# EAGLE design USBchLDO_v2 (EAGLE 8.6.0)
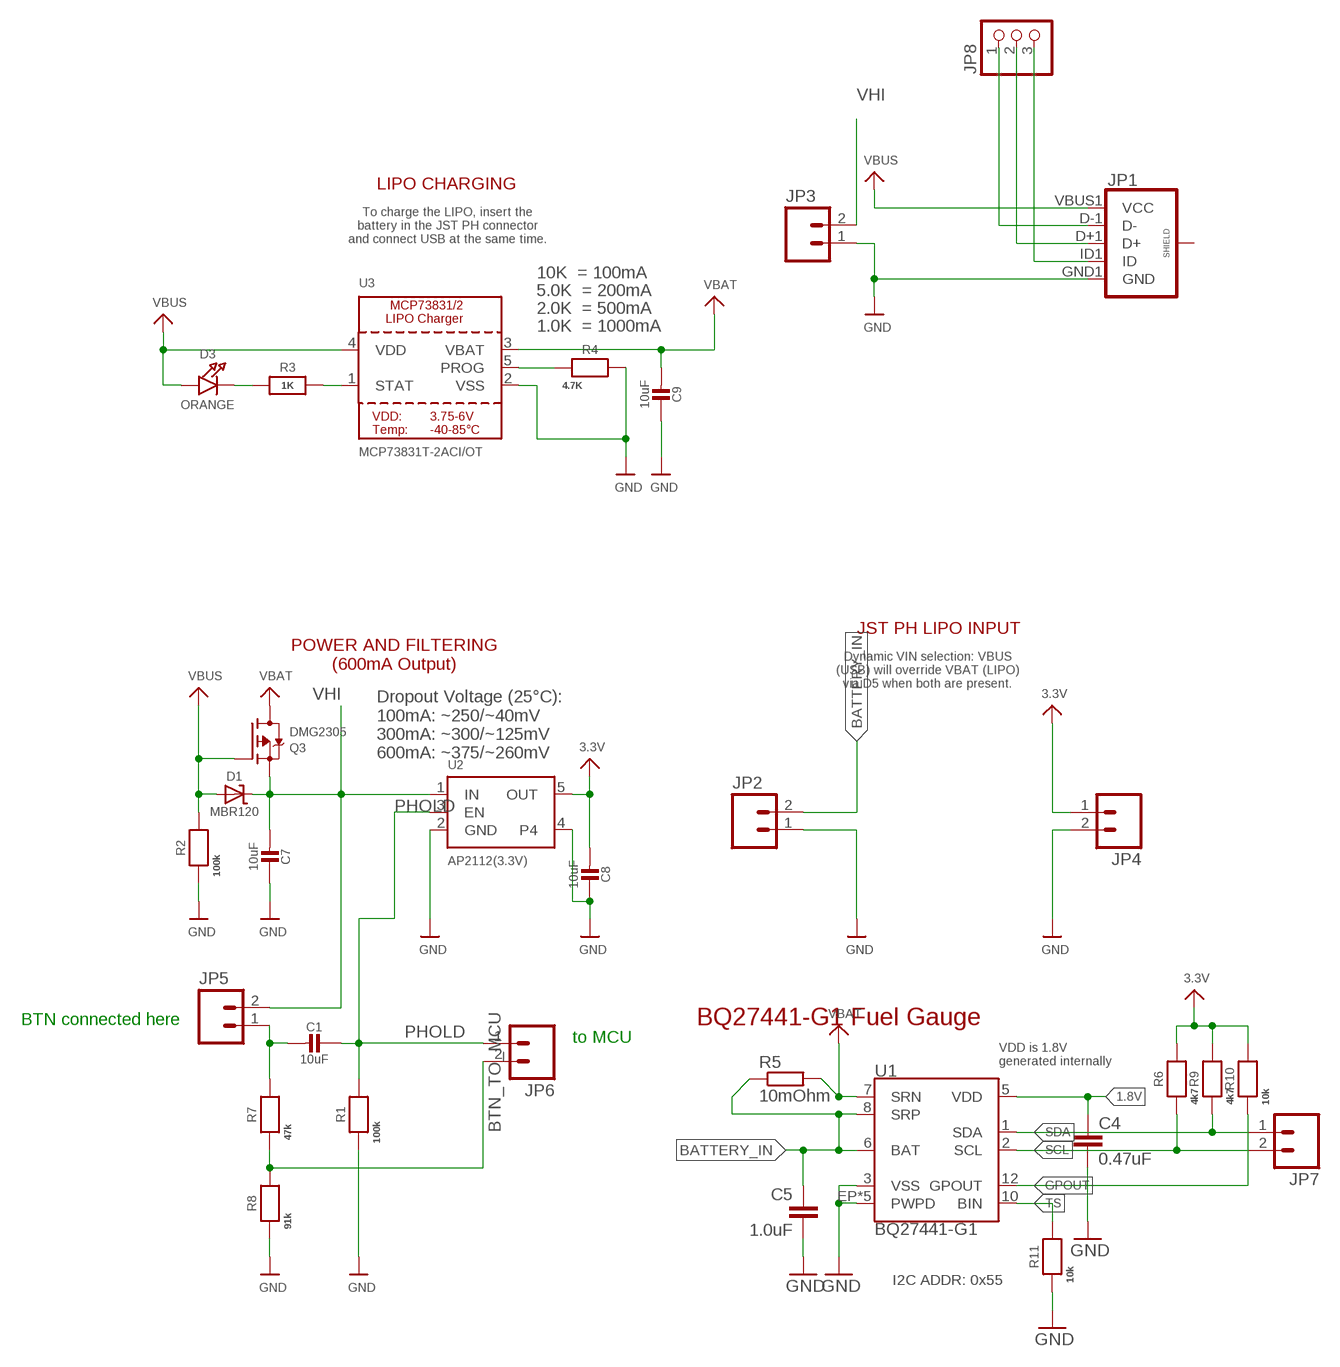
[diagram p0: schematic, sheet 1]

## Parts
C1  10uF  CAP_CERAMIC0805-NOOUTLINE  [0805-NO]
C4  0.47uF  CAP0603-CAP  [0603-CAP]
C5  1.0uF  1.0UF-16V-10%(0603)  [0603-CAP]
C7  10uF  CAP_CERAMIC0805-NOOUTLINE  [0805-NO]
C8  10uF  CAP_CERAMIC0805-NOOUTLINE  [0805-NO]
C9  10uF  CAP_CERAMIC0805-NOOUTLINE  [0805-NO]
D1  MBR120  DIODE-SCHOTTKYSOD-123  [SOD-123]
D3  ORANGE  LED0805_NOOUTLINE  [CHIPLED_0805_NOOUTLINE]
JP1  USB_MICROB_PLUGCONN-11752  [USB-B-MICRO-SMD_V03]
JP2  M02PTH  [1X02]
JP3  M02PTH  [1X02]
JP4  M02PTH  [1X02]
JP5  M02PTH  [1X02]
JP6  M02PTH  [1X02]
JP7  M02PTH  [1X02]
JP8  PINHD-1X3  [1X03]
Q3  DMG2305  MOSFET-P  [SOT23-R]
R1  100k  RESISTOR_0603_NOOUT  [0603-NO]
R2  100k  RESISTOR_0603_NOOUT  [0603-NO]
R3  1K  RESISTOR_0603_NOOUT  [0603-NO]
R4  4.7K  RESISTOR_0603_NOOUT  [0603-NO]
R5  10mOhm  R-EU_R0805  [R0805]
R6  4k7  RESISTOR_0603_NOOUT  [0603-NO]
R7  47k  RESISTOR_0603_NOOUT  [0603-NO]
R8  91k  RESISTOR_0603_NOOUT  [0603-NO]
R9  4k7  RESISTOR_0603_NOOUT  [0603-NO]
R10  10k  RESISTOR_0603_NOOUT  [0603-NO]
R11  10k  RESISTOR_0603_NOOUT  [0603-NO]
U1  BQ27441-G1  [PDSO-N12]
U2  AP2112(3.3V)  VREG_SOT23-5  [SOT23-5]
U3  MCP73831T-2ACI/OT  MCP73831/2  [SOT23-5]

## Nets
1.8V: C4.1 U1.5(VDD)
3.3V [USB]: C8.2 JP4.1 R6.2 R9.2 R10.2 U2.5(OUT)
B_IN: C1.2 JP5.1 R7.2
BATTERY_IN: C5.1 JP2.2 R5.1 U1.6(BAT) U1.8(SRP)
BTN_TO_MCU: JP6.2 R7.1 R8.2
GND: C4.2 C5.2 C7.1 C8.1 C9.1 JP1.GND1(GND) JP2.1 JP3.1 JP4.2 R1.1 R2.1 R4.2 R8.1 R11.1 U1.3(VSS) U1.EP1(PWPD) U1.EP2(PWPD) U1.EP3(PWPD) U1.EP4(PWPD) U1.EP(PWPD) U2.2(GND) U2.4 U3.2(VSS)
GPOUT: R10.1 U1.12(GPOUT)
N$1: D3.C R3.1
N$5: JP1.ID1(ID) JP8.3
N$11: R3.2 U3.1(STAT)
N$12: R4.1 U3.5(PROG)
PHOLD: C1.1 JP6.1 R1.2 U2.3(EN)
SCL: JP7.2 R6.1 U1.2(SCL)
SDA: JP7.1 R9.1 U1.1(SDA)
TS: R11.2 U1.10(BIN)
USB_N: JP1.D-1(D-) JP8.1
USB_P: JP1.D+1(D+) JP8.2
VBAT [USB]: C9.2 Q3.3(D) R5.2 U1.7(SRN) U3.3(VBAT)
VBUS [USB]: D1.A D3.A JP1.VBUS1(VCC) Q3.1(G) R2.2 U3.4(VDD)
VHI [USB]: C7.2 D1.C JP3.2 JP5.2 Q3.2(S) U2.1(IN)
Unconnected: JP1.SHIELD1(SHIELD) JP1.SHIELD2(SHIELD) JP1.SHIELD3(SHIELD)

## Notes on the sheet
- LIPO CHARGING
- To charge the LIPO, insert the
  battery in the JST PH connector
  and connect USB at the same time.
- 10K  = 100mA
- 5.0K  = 200mA
- 2.0K  = 500mA
- 1.0K  = 1000mA
- JST PH LIPO INPUT
- POWER AND FILTERING
  (600mA Output)
- Dynamic VIN selection: VBUS
  (USB) will override VBAT (LIPO)
  via D5 when both are present.
- Dropout Voltage (25°C):
  100mA: ~250/~40mV
  300mA: ~300/~125mV
  600mA: ~375/~260mV
- BQ27441-G1 Fuel Gauge
- BTN connected here
- to MCU
- VDD is 1.8V
  generated internally
- I2C ADDR: 0x55

## Library data of the parts
C1 C7-C9 = microbuilder:CAP_CERAMIC: Ceramic Capacitors For new designs, use the packages preceded by an '_' character since they are more reliable: The following footprints should be used on most boards: _0402 - Standard footprint for regular board layouts _0603 - Standard footprint for regular board layouts _0805 - Standard footprint for regular board layouts _1206 - Standard footprint for regular board layouts For extremely tight-pitch boards where space is at a premium, the following 'micro-pitch' footprints can be used (smaller pads, no silkscreen outline, etc.): _0402MP - Micro-pitch footprint for very dense/compact boards _0603MP - Micro-pitch footprint for very dense/compact boards _0805MP - Micro-pitch footprint for very dense/compact boards _1206MP - Micro-pitch footprint for very dense/compact boards
C4 = SparkFun-Capacitors:CAP: Capacitor Standard 0603 ceramic capacitor, and 0.1" leaded capacitor.; PROD_ID: CAP-13216
C5 = SparkFun-Capacitors:1.0UF-16V-10%(0603): CAP-00868; PROD_ID: CAP-00868
D1 = microbuilder:DIODE-SCHOTTKY
D3 = microbuilder:LED: LED 0603 - 0603 Surface Mount Package 2mA: Green LED - Low Power (3.9mcd, 2ma, 1.7Vf) - Digikey: 475-2709-2-ND Orange LED - Low Power (9.8mcd, 2ma, 1.8Vf) - Digikey: 475-1194-2-ND Red LED - Low Power (5mcd, 2ma, 1.8Vf) - Digikey: 475-1195-2-ND Yellow LED - Low Power (7mcd, 2ma, 1.8Vf) - Digikey: 475-1196-2-ND 5mA: Blue LED - Low Power (17mcd, 5ma, 2.9Vf) - Digikey: LNJ937W8CRACT-ND 0805 - 0805 Surface Mount Package 2mA: Red LED (8.8mcd, 2mA, 1.8Vf, Clear) - Low Power [Digikey: 475-2510-1-ND] Green LED (5mcd, 2mA, 1.8Vf, Clear) - Low Power [Digikey: 475-2730-1-ND] Yellow LED (11.3mcd, 2mA, 1.8Vf, Clear) - Low Power [Digikey: 475-2555-1-ND] 20mA: Red LED (104mcd, 20mA, Diffused) - LS R976 [Digikey: 475-1278-6-ND] Red LED (12mcd, 20mA, 2.0Vf, Clear) - APT2012EC [Digikey: 754-1128-1-ND] Green LED (15mcd, 20mA, 2.2Vf, Clear) - APT2012GC [Digikey: 754-1131-1-ND] Orange LED (160mcd, 20mA, 2.1Vf, Clear) - APT2012SECK [Digikey: 754-1130-1-ND] 1206 - 1206 Surface Mount Package Green LED (26mcd, 20mA, Diffused) - LG N971 [Digikey: 475-1407-6-ND] Red LED (15mcd, 20mA, Diffused) - LH N974 [Digikey: 475-1416-6-ND] Cree - Cree High-Power Surface Mount LEDs XPEBWT-L1-0000-00D50 - White 111lm 350mA 2.9Vf 6200K 110° XTEAWT-00-0000-00000LEE3 - White 114lm 350mA 2.85Vf 5000K 115° Everlight - Everlight 45-21 Series Surface Mount LEDs 45-21/QK2C-B2832AC2CB2/2T - Warm White 2000mcd 20mA 3.25Vf 3050K 120° 45-21/LK2C-B38452C4CB2/2T - Nuetral White 2000mcd 20mA 3.25Vf 4150K 120° 45-21/LK2C-B50634C6CB2/2T - Cold White 2200mcd 20mA 3.25Vf 5650K 120° PLCC2 Reverse Mount LS T77K-J1L2-1-0-2-R18-Z - Red 11.25mcd 2mA 1.8Vf 630nm 120° LO T77K-L1M2-24-Z - Orange 19.6mcd 2mA 1.8Vf 606nm 120° LY T77K-K2M1-26-Z - Yellow 15.7mcd 2mA 1.8Vf 587nm 120°
JP1 = SparkFun-Connectors:USB_MICROB_PLUG: USB Micro-B connectors Some male, some female. Watch your step!; PROD_ID: CONN-11752
JP2-JP7 = SparkFun-Connectors:M02: Standard 2-pin 0.1" header. Use with - straight break away headers ( PRT-00116) - right angle break away headers (PRT-00553) - swiss pins (PRT-00743) - machine pins (PRT-00117) - female headers (PRT-00115) Molex polarized connector foot print use with: PRT-08233 with associated crimp pins and housings. 2.54_SCREWTERM for use with PRT-10571. 3.5mm Screw Terminal footprints for PRT-08084 5mm Screw Terminal footprints for use with PRT-08432
JP8 = adafruit:PINHD-1X3: PIN HEADER
Q3 = microbuilder:MOSFET-P: P-Channel Mosfet LEGEND VDS: Voltage Drain-Source ID: Drain Current RDS(ON): Drain-Source On-State Resistance VGS(TH): Gate-Source Threshold Voltage CISS: Drain-Source Input Capacitance SOT-23 Name VDS ID RDS(ON) VGS(TH) CISS Order Number IRLML5103 30V 760mA 600 mOhm -- 75pF @ 25V Digikey: IRLML5103PBFCT-ND IRLML6401 12V 4.3A 50 mOhm 950mV @ 250µA 830pF @ 10V Digikey: IRLML6401PBFTR-ND NTR0202PL 20V 400mA 800 mOhm 2.3V @ 250uA 70pF @ 5V Digikey: NTR0202PLT1GOSTR-ND NTR4101PT1G 20V 1.8A 85 mOhm 1.2V @ 250uA 675pF @ 10V Digikey: NTR4101PT1GOSCT-ND DMP2004K 20V 600mA 900 mOhm 1V @ 250uA 175pF @ 16V Digikey: DMP2004KDICT-ND PMV65XP 20V 3.9A 76 mOhm 950mV @ 1mA 725pF @ 20V Digikey: 568-2358-2-ND TO-252 Name VDS ID RDS(ON) VGS(TH) CISS Order Number AOD417 30V 25A 34 mOhm 3V @ 250µA 920pF @ 15V Digikey: 785-1106-2-ND PowerPak Name VDS ID RDS(ON) VGS(TH) CISS Order Number AON7401 30V 12A 14 mOhm 3V @ 250µA 2600pF @ 15V Digikey: 785-1302-1-ND
R1-R4 R6-R11 = microbuilder:RESISTOR: Resistors For new designs, use the packages preceded by an '_' character since they are more reliable: The following footprints should be used on most boards: _0402 - Standard footprint for regular board layouts _0603 - Standard footprint for regular board layouts _0805 - Standard footprint for regular board layouts _1206 - Standard footprint for regular board layouts For extremely tight-pitch boards where space is at a premium, the following 'micro-pitch' footprints can be used (smaller pads, no silkscreen outline, etc.): _0402MP - Micro-pitch footprint for very dense/compact boards _0603MP - Micro-pitch footprint for very dense/compact boards _0805MP - Micro-pitch footprint for very dense/compact boards _1206MP - Micro-pitch footprint for very dense/compact boards
R5 = rcl:R-EU_: RESISTOR, European symbol
U1 = battery-management-temp:BQ27441-G1; PROD_ID: IC-13220
U2 = microbuilder:VREG_SOT23-5: SOT23-5 Fixed Voltage Regulators Part Current Out V Out V In V Dropout θJA (°C/W) TJ (°C) Digikey Part No. ADP121 150mA 3.3V 3.4-5.5V 0.09V @ 150mA -- -- ADP121-AUJZ33R7CT-ND ADP121 150mA 3.0V 3.1-5.5V 0.09V @ 150mA -- -- ADP121-AUJZ30R7CT-ND ADP122 300mA 3.3V 3.4-5.5V 0.085V @ 300mA -- -- ADP122AUJZ-3.3-R7CT-ND ADP1712 300mA 3.3V 3.5-5.5V 0.17V @ 300mA -- -- ADP1712AUJZ-3.3-R7TR-ND AP7311 (Low Cost) 150mA 3.3V 3.5-6V 0.15V @ 150mA -- -- AP7311-33WG-7DICT-ND LD39015M18R 150mA 1.8V 1.9V-5.5V 0.08V @ 100mA -- -- 497-6977-1-ND LP2985A-33DBVR 150mA 3.3V 3.3-16V 0.28V @ 150mA 206 150 296-18479-1-ND MCP1824T-3302E/OT 300mA 3.3V 3.5V-6V 0.2V @ 300mA -- -- MCP1824T-3302E/OTCT-ND MIC5205-2.5YM5 TR 150mA 2.5V 2.7-16V 0.165V @ 150mA -- -- 576-1257-2-ND MIC5205-3.0YM5 TR 150mA 3.0V 3.2V-16V 0.165V @ 150mA -- -- 576-1258-2-ND MIC5205-3.3YM5 TR 150mA 3.3V 3.5V-16V 0.165V @ 150mA -- -- 576-1259-2-ND TPS780330220 150mA 3.3V+2.2V 3.6-5.5V 250mV Max -- -- 296-23332-1-ND TDA3663/N1,135 100mA 3.3V 3.5-45V 0.18V @ 50mA -- -- 568-5343-1-ND Max operating temp can be calculated using θJA, TJ (max junction temperature), and power in watts. Set the "Maximum Ambient Temperature" until it reaches TJ ("Max Junction Temperature"), which is the absolute limit for safe use of the regulator: Heat Sink Temperature Calculator <http://www.daycounter.com/Calculators/Heat-Sink-Temperature-Calculator.phtml> For example, With 12V source into a 3.3V LP2985 and a 30mA load, we are dissipating (12V-3.3V) * 0.03A = 0.261W. With a θJA of 206 °C/W, a TJ of 150°C, and 261mW we can safely use the chip without a heat sink up to 75°C (=147.1°C Junction Temperature).
U3 = microbuilder:MCP73831/2: MCP73831/2 LIPO Charger VDD: 3.75 - 6V Temp -40 - 85°C Programmable Charge Rate: 15-500mA NOTE: STAT is a tri-state logic output on the MCP73831 and an open-drain output on the MCP73832. SOT23-5 with 4.2V output and tri-state logic on STAT = MCP73831T-2ACI/OT

## Net classes
1 USB: width 0.406 mm

## Board
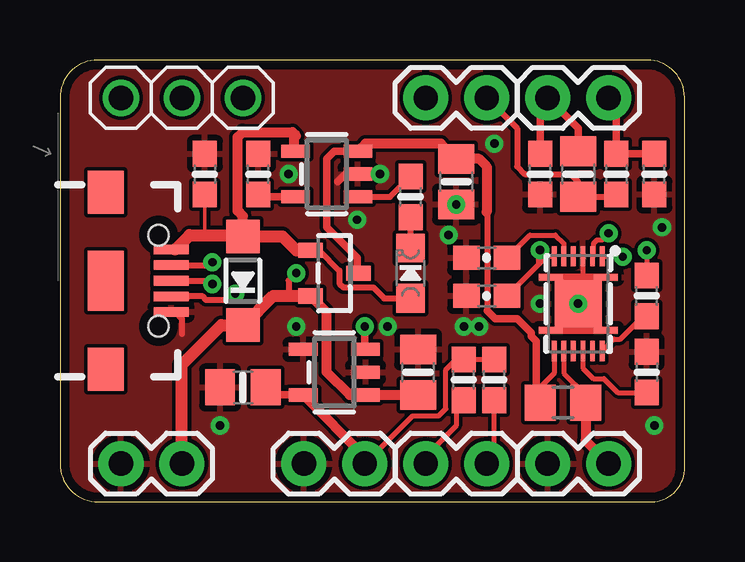
[diagram p1: board, top side]
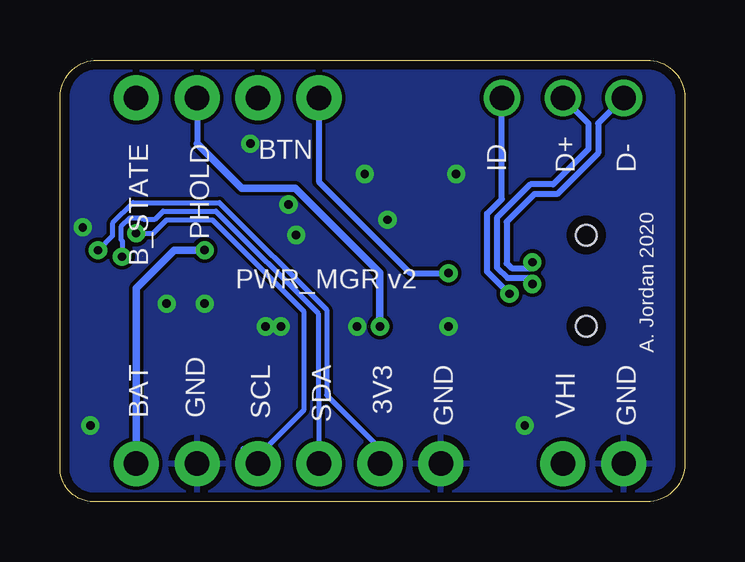
[diagram p2: board, bottom side, seen from below]

Size 26.03 x 18.41 mm. Coordinates in mm from the lower left corner, seen from the top.
Outline: 24.48,18.41 1.57,18.41 arc90 0,16.83 0,1.59 arc90 1.59,0 24.77,0 arc90 26.02,1.57 26.02,16.86 arc90 24.48,18.41
Copper layers (1*16): Top 0.035mm / dielectric 1.5mm / Bottom 0.035mm
Design rules "default *": minimum track width 6mil, minimum drill 0.35mm, track to track 6mil, track to pad 6mil, pad to pad 6mil, via to via 6mil, smd to smd 6mil, copper to edge 15mil, drill to drill 6mil, minimum pad ring 10mil, minimum via ring 8mil, stop-mask expansion 4mil, vias tented up to drill 20mil, thermal gap 10mil

### Footprints (pad centres in the part's own frame; a part is rotated, then mirrored left to right if it is on the bottom)
0805-NO = smd 1.24 x 1.5: 1 -0.95,0; 2 0.95,0
0603-CAP = smd 1.1 x 1: 1 -0.85,0; 2 0.85,0
SOD-123 = smd 1.4 x 1.4: A 1.85,0; C -1.85,0
CHIPLED_0805_NOOUTLINE = smd 1.2 x 1.2: A 0,-1.05; C 0,1.05
USB-B-MICRO-SMD_V03 = smd 1.45 x 0.4: D+1 2.725,0; D-1 2.725,0.65; GND1 2.725,-1.3; ID1 2.725,-0.65; VBUS1 2.725,1.3 | smd 1.5 x 1.8: SHIELD1 0,3.685; SHIELD2 0,-3.685 | smd 1.5 x 2.5: SHIELD3 0,0 | hole 0.85: 2.2,1.9; 2.2,-1.9
1X02 = drill 1.016 pad 1.88: 1 0,0; 2 2.54,0
1X03 = drill 1.016: 1 -2.54,0; 2 0,0; 3 2.54,0
SOT23-R = smd 0.635 x 1.016: 1 -0.95,-1; 2 0.95,-1; 3 0,1
0603-NO = smd 1.075 x 1: 1 -0.85,0; 2 0.85,0
R0805 = smd 1.3 x 1.5: 1 -0.95,0; 2 0.95,0
PDSO-N12 = smd 0.2 x 0.85: 1 -1,-1.975; 2 -0.6,-1.975; 3 -0.2,-1.975; 4 0.2,-1.975; 5 0.6,-1.975; 6 1,-1.975; 7 1,1.975; 8 0.6,1.975; 9 0.2,1.975; 10 -0.2,1.975; 11 -0.6,1.975; 12 -1,1.975 | smd 1.95 x 1.95: EP 0,0 | smd 1 x 0.25: EP1 -1.15,1.1; EP2 -1.15,-1.1; EP3 1.15,-1.1; EP4 1.15,1.1
SOT23-5 = smd 0.55 x 1.2: 1 -0.95,-1.3; 2 0,-1.3; 3 0.95,-1.3; 4 0.95,1.3; 5 -0.95,1.3

### Placement (x,y rotation side)
C1  21.59,13.65 270 top
C4  17.78,10.16 180 top
C5  17.78,8.57 180 top
C7  14.92,5.4 270 top
C8  7.62,4.76 0 top
C9  16.51,13.33 90 top
D1  7.62,9.21 90 top
D3  14.61,9.52 0 top
JP1  1.91,9.21 0 top
JP2  20.32,1.59 0 top
JP3  2.54,1.59 0 top
JP4  12.7,1.59 180 top
JP5  17.78,16.83 180 top
JP6  20.32,16.83 0 top
JP7  15.24,1.59 0 top
JP8  5.08,16.83 0 top
Q3  11.43,9.52 270 top
R1  20,13.65 90 top
R2  6.03,13.65 270 top
R3  14.61,12.7 90 top
R4  8.26,13.65 90 top
R5  20.95,4.13 180 top
R6  18.1,5.08 90 top
R7  23.18,13.65 270 top
R8  24.77,13.65 90 top
R9  16.83,5.08 90 top
R10  24.45,8.57 90 top
R11  24.45,5.4 270 top
U1  21.59,8.25 180 top
U2  11.43,5.4 90 top
U3  11.11,13.65 90 top

### Tracks (layer width: path | path; a pad name or v marks a point on that pad's centre or on a via)
1.8V
  Top 0.203: C4.1 19.58,11.11 20.64,11.11 20.99,10.76 U1.5
3.3V  (via drill 0.35)
  Top 0.2: JP4.1 14.69,3.58 15.78,3.58 16.07,3.87 16.07,5.51 16.51,5.94 R9.2 R6.2
  Top 0.203: v24.45,10.48 R10.2
  Top 0.305: C8.2 8.57,4.45 U2.5
  Top 0.406: U2.5 12.7,1.88 JP4.1
  Bottom 0.203: v24.45,10.48 23.85,11.08 23.85,11.59 22.98,12.46 19.39,12.46 14.92,7.99 14.92,4.44 12.7,2.22 JP4.1
B_IN
  Top 0.254: JP5.1 19.05,15.56 19.05,13.97 19.37,13.65 21.27,13.65 21.59,13.33 C1.2 23.08,12.7 R7.2
BATTERY_IN  (via drill 0.35)
  Top 0.203: U1.8 20.99,5.36 21.91,4.45 | C5.1 19.95,9.89 | 19.95,9.89 20.29,10.23 U1.6 | 19.95,9.89 19.95,10.43 v20,10.48
  Top 0.254: 21.91,4.45 R5.1
  Top 0.406: R5.1 21.91,2.54 JP2.2
  Bottom 0.305: JP2.2 22.86,8.89 21.27,10.48 v20,10.48
BTN_TO_MCU
  Top 0.305: R8.2 R7.1 23.18,16.51 JP6.2
GND  (via drill 0.35)
  Top 0.2: U1.EP1 22.05,7.15 21.59,7.62 | 21.59,7.62 U1.EP 21.59,8.89 | U1.EP4 21.12,7.15 21.59,7.62 | U1.EP2 22.05,9.35 21.75,9.05 21.59,8.89 | U1.EP3 21.12,9.35 21.59,8.89
  Top 0.203: U1.3 21.79,9.09 21.75,9.05
  Top 0.254: JP1.GND1 4.79,7.91 5.08,7.62 5.08,6.99
  Top 0.305: U3.2 11.89,13.65 11.57,13.33
  other vias: 21.59,8.25 9.84,7.3 13.65,7.3 13.34,13.65 9.53,13.65 16.83,7.3 17.46,7.3 16.51,12.38 16.19,11.11 25.08,11.43 6.67,3.18 12.38,11.75 18.1,14.92 20,8.25 24.77,3.18
  pour Bottom: -2.22,20.64 -2.22,-2.86 28.26,-2.86 28.26,20.32 -0.64,20.32 -0.64,20.64
  pour Top: -0.95,19.05 -0.95,-1.59 26.99,-1.59 26.99,19.05
GPOUT
  Top 0.203: U1.12 23.08,6.77 23.35,6.77 24.3,7.72 R10.1
N$1
  Top 0.254: D3.C R3.1
N$5  (via drill 0.35)
  Top 0.254: JP1.ID1 5.38,8.56 5.4,8.57 5.92,8.57 6.08,8.41 7.05,8.41 v7.3,8.66
  Bottom 0.254: v7.3,8.66 7.55,8.92 8.23,9.59 8.23,12 7.62,12.61 JP8.3
N$11
  Top 0.254: 12.52,12.6 U3.1 13.65,12.7 13.76,12.7 R3.2
N$12
  Top 0.305: R4.1 8.36,12.7 U3.5
PHOLD  (via drill 0.35)
  Top 0.305: C1.1 21.59,15.56 JP6.1 20,16.51 R1.2 | v12.7,7.3 12.7,6.38 U2.3
  Bottom 0.254: JP6.1 20.32,14.92
  Bottom 0.305: 20.32,14.92 18.46,13.07 16.23,13.07 12.7,9.54 v12.7,7.3
SCL  (via drill 0.35)
  Top 0.2: JP7.2 18.1,1.59 R6.1
  Top 0.203: U1.2 22.24,10.28 22.24,10.76 22.39,10.91 22.58,10.91 v22.86,11.19
  Bottom 0.203: JP7.2 17.94,1.75 | 17.94,1.75 18.41,2.22 | v22.86,11.19 22.15,11.19 21.59,11.75 19.68,11.75 15.88,7.94 15.88,3.81 17.94,1.75
SDA  (via drill 0.35)  (1 unrouted)
  Top 0.2: R9.1 16.51,3.91 16.51,3.18 15.24,1.9 JP7.1
  Top 0.203: v23.45,10.21 22.61,10.21 U1.1
  Bottom 0.203: v23.45,10.21 23.45,10.88 23.49,10.92 23.49,11.45 23.12,11.82 22.6,11.82 22.54,11.75 22.09,11.75 21.74,12.1 19.54,12.1 15.28,7.84 15.28,4.3 15.24,4.26 JP7.1
TS
  Top 0.203: U1.10 21.79,5.57 22.23,5.13 22.66,5.13 23.24,4.55 R11.2
USB_N  (via drill 0.35)
  Top 0.254: 6.35,9.73 v6.35,9.98 6.23,9.86 JP1.D-1
  Bottom 0.254: JP8.1 3.61,15.76 3.61,14.52 5.31,12.81 6.27,12.81 7.42,11.66 7.42,9.93 7.22,9.73 6.35,9.73 v6.35,9.98
USB_P  (via drill 0.35)
  Top 0.152: 4.74,9.32 JP1.D+1
  Top 0.254: 6.35,9.32 v6.35,9.07 6.21,9.21 JP1.D+1
  Bottom 0.254: JP8.2 4.01,15.76 4.01,14.69 5.48,13.22 6.43,13.22 7.82,11.83 7.82,9.76 7.39,9.32 6.35,9.32 v6.35,9.07
VBAT
  Top 0.203: U1.7 20.59,5.35 19.84,4.61 19.84,4.44 19.84,4.29
  Top 0.254: 17.78,12.07 17.8,12.04 17.8,7.96
  Top 0.305: 17.8,7.96 18.14,7.62 19.05,7.62 19.63,7.04 19.63,6.9 19.84,6.68 19.84,4.44 | 19.84,4.29 R5.2 | U3.3 11.43,14.6 11.11,14.29 11.11,11.43 12.38,10.16 12.38,9.57 Q3.3
  Top 0.406: 17.78,12.07 17.78,13.97 17.46,14.29 C9.2 15.87,14.92 12.73,14.92 U3.3
VBUS
  Top 0.152: R2.2 6.03,11.11
  Top 0.254: JP1.VBUS1 4.79,10.51 | Q3.1 10.8,10.48 11.64,9.63 11.64,9.09 11.81,8.93 13.05,8.93 13.51,8.48 D3.A
  Top 0.406: D1.A 7.62,11.9 7.4,12.12 7.4,15.19 7.61,15.4 9.69,15.4 9.84,15.24 9.74,15.14 9.74,14.67 U3.4
  Top 0.508: 4.79,10.51 5.4,11.11 6.03,11.11 7.57,11.11 D1.A 9.26,11.06 9.85,10.48 Q3.1
VHI  (via drill 0.35)
  Top 0.254: v9.84,9.52 9.53,9.21 9.53,8.57
  Top 0.406: C7.2 U2.1 12.06,4.45 11.11,5.4 11.11,7.89 Q3.2
  Top 0.508: Q3.2 9.53,8.57 8.89,8.57 7.67,7.36 D1.C 6.72,7.36 5.08,5.72 JP3.2
  Bottom 0.254: JP5.2 15.24,13.33 11.43,9.52 v9.84,9.52

### Text on the board
bPlace: D- | D+ | ID | PHOLD | B_STATE | BTN | A. Jordan 2020 | PWR_MGR v2 | GND | GND | 3V3 | SDA | SCL | BAT | VHI | GND